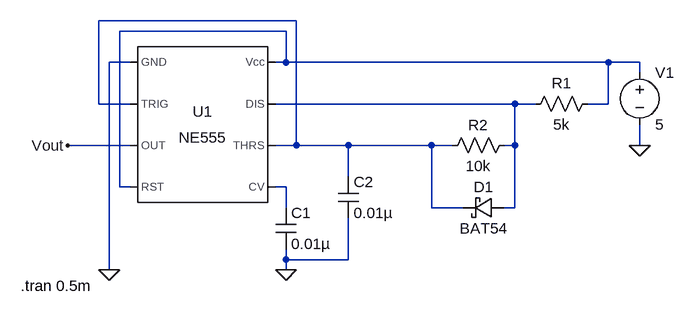
[diagram p0: schematic Astable_33.asc]
Astable_33.asc, the LTspice schematic file:
Version 4
SHEET 1 880 680
WIRE 80 -48 -224 -48
WIRE 64 -32 -192 -32
WIRE -176 16 -208 16
WIRE 64 16 64 -32
WIRE 64 16 48 16
WIRE 560 16 64 16
WIRE 608 16 560 16
WIRE 608 32 608 16
WIRE -224 80 -224 -48
WIRE -176 80 -224 80
WIRE 416 80 48 80
WIRE 448 80 416 80
WIRE 560 80 560 16
WIRE 560 80 528 80
WIRE -176 144 -272 144
WIRE 80 144 80 -48
WIRE 80 144 48 144
WIRE 160 144 80 144
WIRE 288 144 160 144
WIRE 320 144 288 144
WIRE 416 144 416 80
WIRE 416 144 400 144
WIRE 608 144 608 112
WIRE 160 192 160 144
WIRE -192 208 -192 -32
WIRE -176 208 -192 208
WIRE 64 208 48 208
WIRE 64 240 64 208
WIRE 288 240 288 144
WIRE 336 240 288 240
WIRE 416 240 416 144
WIRE 416 240 400 240
WIRE 64 320 64 304
WIRE 160 320 160 256
WIRE 160 320 64 320
WIRE -208 336 -208 16
WIRE 64 336 64 320
FLAG 64 336 0
FLAG -208 336 0
FLAG 608 144 0
FLAG -272 144 Vout
SYMBOL Misc\\NE555 -64 112 R0
SYMATTR InstName U1
SYMBOL cap 48 240 R0
SYMATTR InstName C1
SYMATTR Value 0.01µ
SYMBOL voltage 608 16 R0
WINDOW 123 0 0 Left 0
WINDOW 39 0 0 Left 0
SYMATTR InstName V1
SYMATTR Value 5
SYMBOL res 544 64 R90
WINDOW 0 0 56 VBottom 2
WINDOW 3 32 56 VTop 2
SYMATTR InstName R1
SYMATTR Value 5k
SYMBOL res 416 128 R90
WINDOW 0 0 56 VBottom 2
WINDOW 3 32 56 VTop 2
SYMATTR InstName R2
SYMATTR Value 10k
SYMBOL cap 144 192 R0
SYMATTR InstName C2
SYMATTR Value 0.01µ
SYMBOL schottky 400 224 R90
WINDOW 0 0 32 VBottom 2
WINDOW 3 32 32 VTop 2
SYMATTR InstName D1
SYMATTR Value BAT54
SYMATTR Description Diode
SYMATTR Type diode
TEXT -344 360 Left 2 !.tran 0.5m

The netlist it stands for:
* Astable_33.asc
XU1 0 N001 Vout N002 N004 N001 N003 N002 NE555  ; pins GND TRIG OUT RST CV THRS DIS Vcc
C1 N004 0 0.01µ
V1 N002 0 5
R1 N002 N003 5k
R2 N003 N001 10k
C2 N001 0 0.01µ
D1 N003 N001 BAT54
.model D D
.lib standard.dio
.tran 0.5m
.lib NE555.sub
.backanno
.end